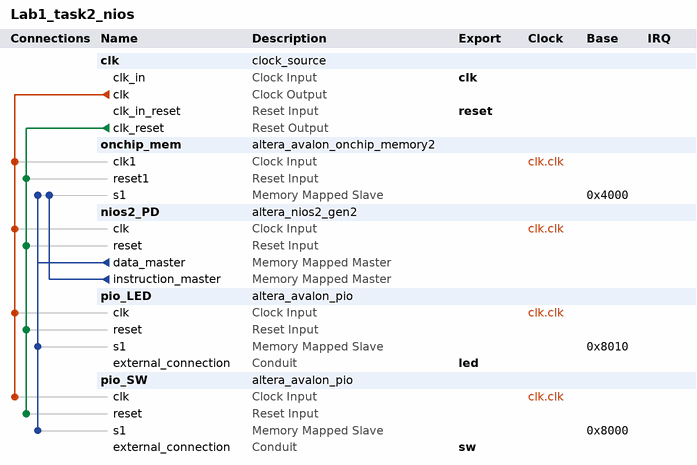
[diagram p0: system contents]
# Platform Designer (Qsys) system Lab1_task2_nios, Cyclone IV E EP4CE6E22C8
# Parameters at their usual value, and those the tool derives, are not listed.
package require -exact qsys 18.1
create_system Lab1_task2_nios
set_project_property DEVICE_FAMILY {Cyclone IV E}
set_project_property DEVICE EP4CE6E22C8

add_instance clk clock_source 18.1
set_instance_parameter_value clk clockFrequency 50000000

add_instance onchip_mem altera_avalon_onchip_memory2 18.1
set_instance_parameter_value onchip_mem dataWidth 32
set_instance_parameter_value onchip_mem dualPort false
set_instance_parameter_value onchip_mem initMemContent true
set_instance_parameter_value onchip_mem initializationFileName onchip_mem.hex
set_instance_parameter_value onchip_mem memorySize 16384
set_instance_parameter_value onchip_mem useNonDefaultInitFile true

add_instance nios2_PD altera_nios2_gen2 18.1
set_instance_parameter_value nios2_PD dcache_size 2048
set_instance_parameter_value nios2_PD debug_enabled false
set_instance_parameter_value nios2_PD exceptionSlave onchip_mem.s1
set_instance_parameter_value nios2_PD icache_size 4096
set_instance_parameter_value nios2_PD impl Tiny
set_instance_parameter_value nios2_PD resetSlave onchip_mem.s1

add_instance pio_LED altera_avalon_pio 18.1
set_instance_parameter_value pio_LED direction Output
set_instance_parameter_value pio_LED width 8

add_instance pio_SW altera_avalon_pio 18.1
set_instance_parameter_value pio_SW direction Input
set_instance_parameter_value pio_SW width 8

# connections
add_connection clk.clk nios2_PD.clk clock
add_connection clk.clk onchip_mem.clk1 clock
add_connection clk.clk pio_LED.clk clock
add_connection clk.clk pio_SW.clk clock
add_connection clk.clk_reset nios2_PD.reset reset
add_connection clk.clk_reset onchip_mem.reset1 reset
add_connection clk.clk_reset pio_LED.reset reset
add_connection clk.clk_reset pio_SW.reset reset
add_connection nios2_PD.data_master onchip_mem.s1 avalon
set_connection_parameter_value nios2_PD.data_master/onchip_mem.s1 baseAddress 0x4000
add_connection nios2_PD.data_master pio_LED.s1 avalon
set_connection_parameter_value nios2_PD.data_master/pio_LED.s1 baseAddress 0x8010
add_connection nios2_PD.data_master pio_SW.s1 avalon
set_connection_parameter_value nios2_PD.data_master/pio_SW.s1 baseAddress 0x8000
add_connection nios2_PD.instruction_master onchip_mem.s1 avalon
set_connection_parameter_value nios2_PD.instruction_master/onchip_mem.s1 baseAddress 0x4000

# exported interfaces
add_interface clk clock sink
set_interface_property clk EXPORT_OF clk.clk_in
add_interface led conduit end
set_interface_property led EXPORT_OF pio_LED.external_connection
add_interface reset reset sink
set_interface_property reset EXPORT_OF clk.clk_in_reset
add_interface sw conduit end
set_interface_property sw EXPORT_OF pio_SW.external_connection

set_interconnect_requirement {$system} qsys_mm.clockCrossingAdapter HANDSHAKE
set_interconnect_requirement {$system} qsys_mm.enableEccProtection FALSE
set_interconnect_requirement {$system} qsys_mm.insertDefaultSlave FALSE
set_interconnect_requirement {$system} qsys_mm.maxAdditionalLatency 1

save_system Lab1_task2_nios.qsys
